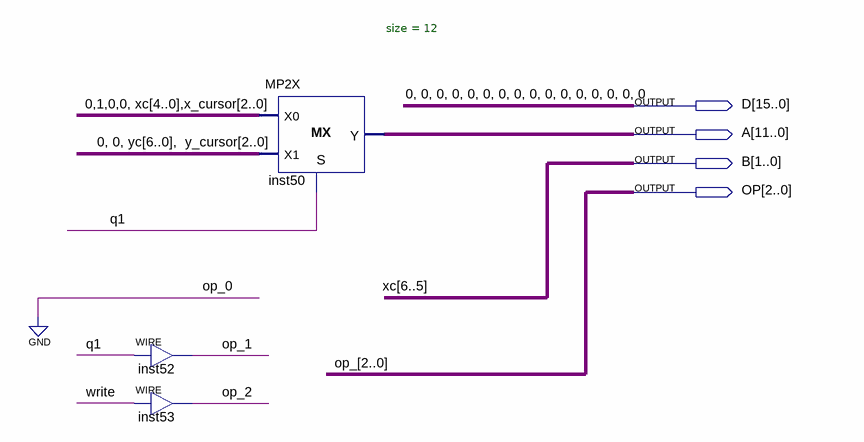
[diagram p0: schematic sheet]
// Quartus schematic trash.bdf as structural Verilog: 3 symbols, 4 pins
module trash (
  output [15:0] D,
  output [11:0] A,
  output [1:0] B,
  output [2:0] OP
);

  wire \1 , q1, write;
  wire [2:0] x_cursor, y_cursor;
  wire [4:0] xc;
  wire [6:0] yc;

  assign OP[1] = q1;  // WIRE inst52
  assign OP[2] = write;  // WIRE inst53
  MP2X #(.size(12)) inst50 (
    .S(q1), .X0({D[15], \1 , {2{D[15]}}, xc, x_cursor}), .X1({{2{D[15]}}, yc, y_cursor}), .Y(A));

  assign D[14:0] = {15{D[15]}};
  assign OP[0] = 1'b0;

  // Other names for the same wires on the sheet: 0 = D[15]; xc[6:5] = B; op_[2:1] = OP[2:1]; op_1 = OP[1];
  //   op_2 = OP[2]
endmodule
